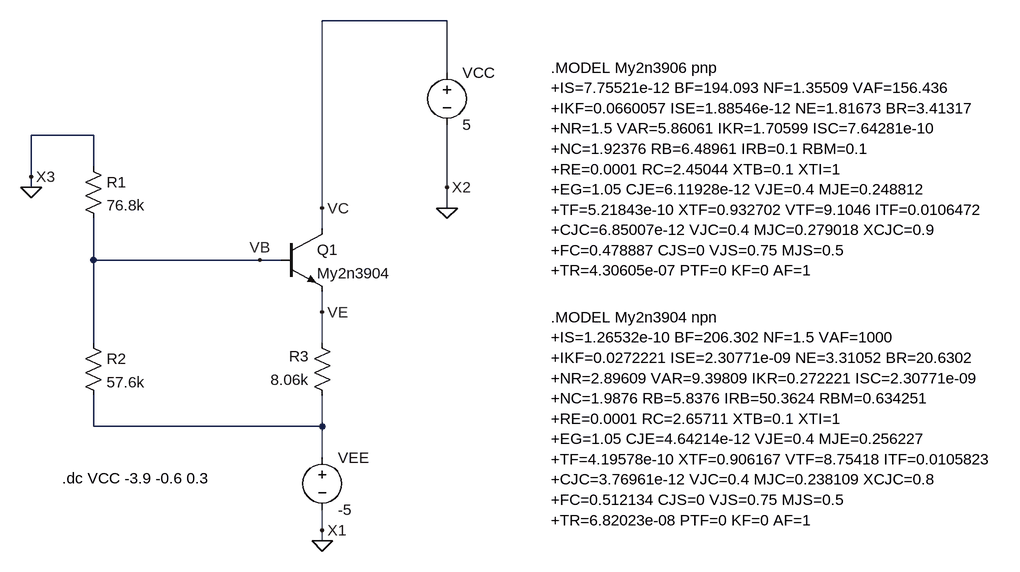
[diagram p0: schematic project2_p1a.asc]
project2_p1a.asc, the LTspice schematic file:
Version 4
SHEET 1 1432 700
WIRE 480 -224 288 -224
WIRE 480 -144 480 -224
WIRE -64 -48 -160 -48
WIRE -64 0 -64 -48
WIRE -160 16 -160 -48
WIRE -160 32 -160 16
WIRE 480 32 480 -64
WIRE 288 64 288 -224
WIRE 480 64 480 32
WIRE 288 96 288 64
WIRE -64 144 -64 80
WIRE 192 144 -64 144
WIRE 224 144 192 144
WIRE 288 224 288 192
WIRE -64 272 -64 144
WIRE 288 272 288 224
WIRE -64 400 -64 352
WIRE 288 400 288 352
WIRE 288 400 -64 400
WIRE 288 448 288 400
WIRE 288 560 288 528
WIRE 288 576 288 560
FLAG -160 32 0
FLAG 480 64 0
FLAG 288 576 0
FLAG 288 560 X1
FLAG -160 16 X3
FLAG 480 32 X2
FLAG 288 64 VC
FLAG 288 224 VE
FLAG 192 144 VB
SYMBOL npn 224 96 R0
SYMATTR InstName Q1
SYMATTR Value My2n3904
SYMBOL voltage 288 432 R0
WINDOW 123 0 0 Left 0
WINDOW 39 0 0 Left 0
SYMATTR InstName VEE
SYMATTR Value -5
SYMBOL voltage 480 -160 R0
WINDOW 123 0 0 Left 0
WINDOW 39 0 0 Left 0
SYMATTR InstName VCC
SYMATTR Value 5
SYMBOL res 304 368 R180
WINDOW 0 36 76 Left 2
WINDOW 3 36 40 Left 2
SYMATTR InstName R3
SYMATTR Value 8.06k
SYMBOL res -80 256 R0
SYMATTR InstName R2
SYMATTR Value 57.6k
SYMBOL res -80 -16 R0
SYMATTR InstName R1
SYMATTR Value 76.8k
TEXT 640 232 Left 2 !.MODEL My2n3904 npn\n+IS=1.26532e-10 BF=206.302 NF=1.5 VAF=1000\n+IKF=0.0272221 ISE=2.30771e-09 NE=3.31052 BR=20.6302\n+NR=2.89609 VAR=9.39809 IKR=0.272221 ISC=2.30771e-09\n+NC=1.9876 RB=5.8376 IRB=50.3624 RBM=0.634251\n+RE=0.0001 RC=2.65711 XTB=0.1 XTI=1\n+EG=1.05 CJE=4.64214e-12 VJE=0.4 MJE=0.256227\n+TF=4.19578e-10 XTF=0.906167 VTF=8.75418 ITF=0.0105823\n+CJC=3.76961e-12 VJC=0.4 MJC=0.238109 XCJC=0.8\n+FC=0.512134 CJS=0 VJS=0.75 MJS=0.5\n+TR=6.82023e-08 PTF=0 KF=0 AF=1
TEXT -112 480 Left 2 !.dc VCC -3.9 -0.6 0.3
TEXT 640 -152 Left 2 !.MODEL My2n3906 pnp\n+IS=7.75521e-12 BF=194.093 NF=1.35509 VAF=156.436\n+IKF=0.0660057 ISE=1.88546e-12 NE=1.81673 BR=3.41317\n+NR=1.5 VAR=5.86061 IKR=1.70599 ISC=7.64281e-10\n+NC=1.92376 RB=6.48961 IRB=0.1 RBM=0.1\n+RE=0.0001 RC=2.45044 XTB=0.1 XTI=1\n+EG=1.05 CJE=6.11928e-12 VJE=0.4 MJE=0.248812\n+TF=5.21843e-10 XTF=0.932702 VTF=9.1046 ITF=0.0106472\n+CJC=6.85007e-12 VJC=0.4 MJC=0.279018 XCJC=0.9\n+FC=0.478887 CJS=0 VJS=0.75 MJS=0.5\n+TR=4.30605e-07 PTF=0 KF=0 AF=1

The netlist it stands for:
* project2_p1a.asc
Q1 VC VB VE 0 My2n3904
VEE N001 0 -5
VCC VC 0 5
R3 N001 VE 8.06k
R2 VB N001 57.6k
R1 0 VB 76.8k
.model NPN NPN
.model PNP PNP
.lib standard.bjt
.MODEL My2n3904 npn
+IS=1.26532e-10 BF=206.302 NF=1.5 VAF=1000
+IKF=0.0272221 ISE=2.30771e-09 NE=3.31052 BR=20.6302
+NR=2.89609 VAR=9.39809 IKR=0.272221 ISC=2.30771e-09
+NC=1.9876 RB=5.8376 IRB=50.3624 RBM=0.634251
+RE=0.0001 RC=2.65711 XTB=0.1 XTI=1
+EG=1.05 CJE=4.64214e-12 VJE=0.4 MJE=0.256227
+TF=4.19578e-10 XTF=0.906167 VTF=8.75418 ITF=0.0105823
+CJC=3.76961e-12 VJC=0.4 MJC=0.238109 XCJC=0.8
+FC=0.512134 CJS=0 VJS=0.75 MJS=0.5
+TR=6.82023e-08 PTF=0 KF=0 AF=1
.dc VCC -3.9 -0.6 0.3
.MODEL My2n3906 pnp
+IS=7.75521e-12 BF=194.093 NF=1.35509 VAF=156.436
+IKF=0.0660057 ISE=1.88546e-12 NE=1.81673 BR=3.41317
+NR=1.5 VAR=5.86061 IKR=1.70599 ISC=7.64281e-10
+NC=1.92376 RB=6.48961 IRB=0.1 RBM=0.1
+RE=0.0001 RC=2.45044 XTB=0.1 XTI=1
+EG=1.05 CJE=6.11928e-12 VJE=0.4 MJE=0.248812
+TF=5.21843e-10 XTF=0.932702 VTF=9.1046 ITF=0.0106472
+CJC=6.85007e-12 VJC=0.4 MJC=0.279018 XCJC=0.9
+FC=0.478887 CJS=0 VJS=0.75 MJS=0.5
+TR=4.30605e-07 PTF=0 KF=0 AF=1
.backanno
.end